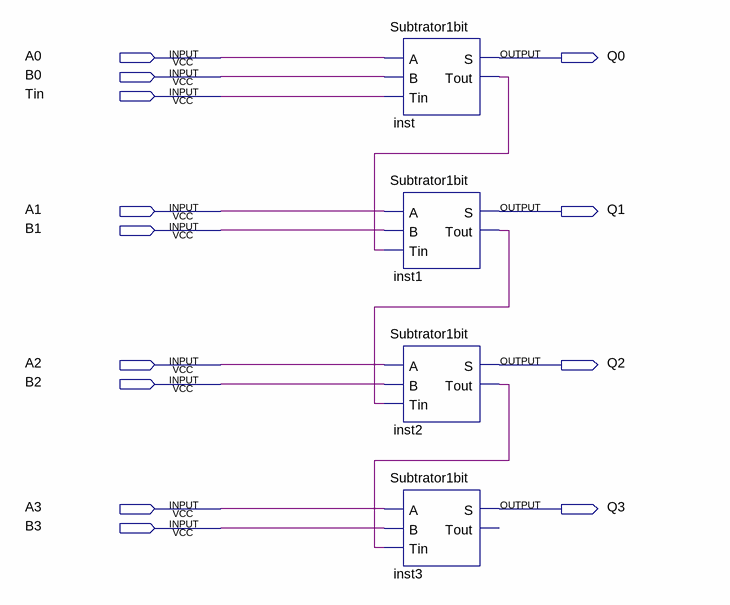
[diagram p0: schematic sheet]
// Quartus schematic subtrator4bitss.bdf as structural Verilog: 4 symbols, 13 pins
module subtrator4bitss (
  input  A0,
  input  B0,
  input  Tin,
  input  A1,
  input  B1,
  input  A2,
  input  B2,
  input  A3,
  input  B3,
  output Q0,
  output Q1,
  output Q2,
  output Q3
);

  wire inst1_tout, inst2_tout, inst_tout;

  Subtrator1bit inst (.A(A0), .B(B0), .Tin(Tin), .S(Q0), .Tout(inst_tout));
  Subtrator1bit inst1 (.A(A1), .B(B1), .Tin(inst_tout), .S(Q1), .Tout(inst1_tout));
  Subtrator1bit inst2 (.A(A2), .B(B2), .Tin(inst1_tout), .S(Q2), .Tout(inst2_tout));
  Subtrator1bit inst3 (.A(A3), .B(B3), .Tin(inst2_tout), .S(Q3));  // open: Tout
endmodule
